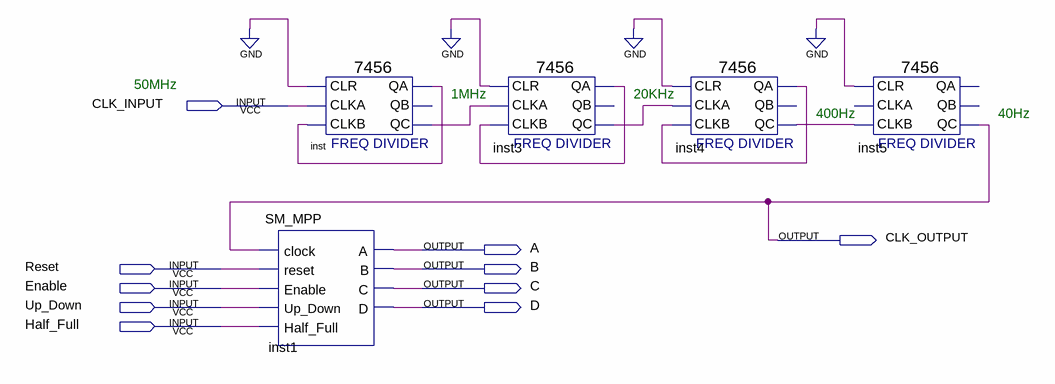
[diagram p0: schematic sheet]
// Quartus schematic M_PasoAPaso.bdf as structural Verilog: 5 symbols, 10 pins
module M_PasoAPaso (
  input  CLK_INPUT,
  input  Reset,
  input  Enable,
  input  Up_Down,
  input  Half_Full,
  output CLK_OUTPUT,
  output A,
  output B,
  output C,
  output D
);

  wire inst3_qa, inst3_qc, inst4_qa, inst4_qc, inst_qa, inst_qc;

  SM_MPP inst1 (
    .clock(CLK_OUTPUT), .reset(Reset), .Enable(Enable), .Up_Down(Up_Down), .Half_Full(Half_Full), .A(A),
    .B(B), .C(C), .D(D));
  \7456  inst (.CLKB(inst_qa), .CLR(1'b0), .CLKA(CLK_INPUT), .QC(inst_qc), .QA(inst_qa));  // open: QB
  \7456  inst3 (.CLKB(inst3_qa), .CLR(1'b0), .CLKA(inst_qc), .QC(inst3_qc), .QA(inst3_qa));  // open: QB
  \7456  inst4 (.CLKB(inst4_qa), .CLR(1'b0), .CLKA(inst3_qc), .QC(inst4_qc), .QA(inst4_qa));  // open: QB
  \7456  inst5 (.CLKB(inst4_qc), .CLR(1'b0), .QC(CLK_OUTPUT));  // open: CLKA, QA, QB

  // Notes on the sheet:
  //   50MHz
  //   1MHz
  //   20KHz
  //   400Hz
  //   40Hz
endmodule
